# EasyEDA Pro project JumpingJack电路图工程文件.eprj

# Schematic Schematic1
Create Date: 2024-07-07; Page Name: JumpingJack; Project Name: JumpingJack; Schematic Name: Schematic1; Update Date: 2024-07-07; Company: 嘉立创EDA; Page Size: A2; Version: V1.0
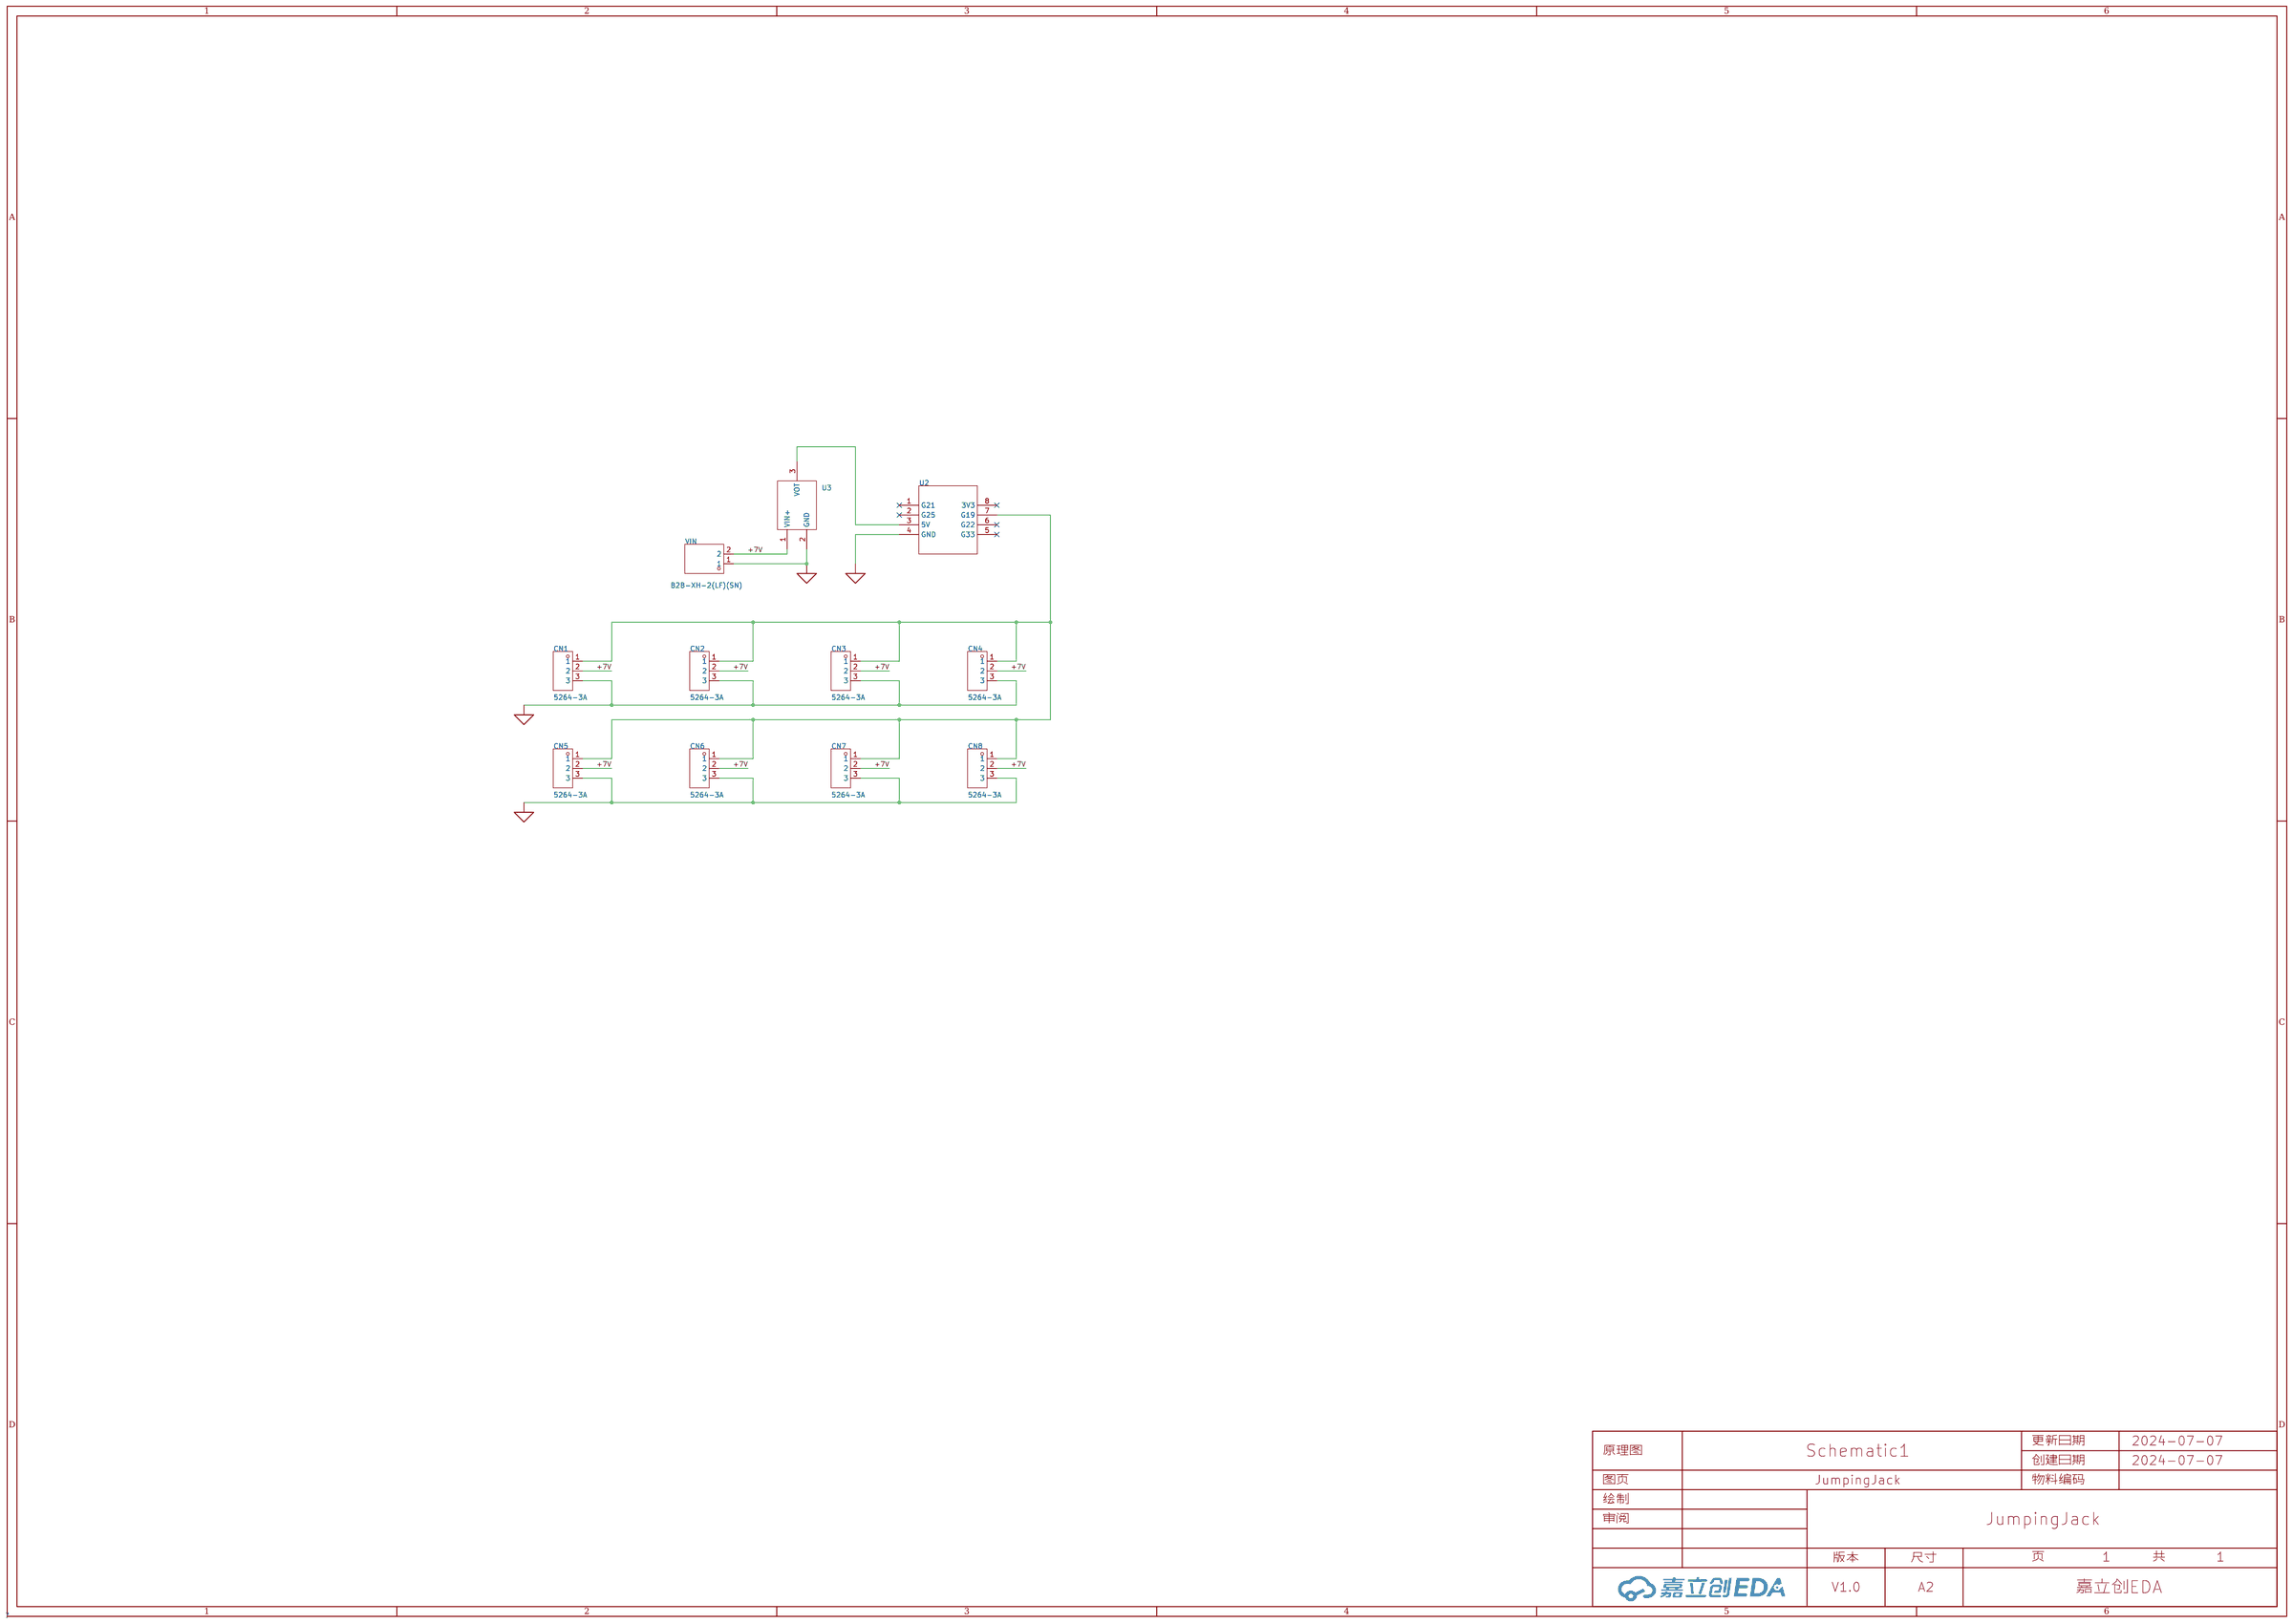
[diagram p0: schematic sheet]

## Parts
CN1  5264-3A  [CONN-TH_5264-3A]
CN2  5264-3A  [CONN-TH_5264-3A]
CN3  5264-3A  [CONN-TH_5264-3A]
CN4  5264-3A  [CONN-TH_5264-3A]
CN5  5264-3A  [CONN-TH_5264-3A]
CN6  5264-3A  [CONN-TH_5264-3A]
CN7  5264-3A  [CONN-TH_5264-3A]
CN8  5264-3A  [CONN-TH_5264-3A]
U2  -  [SOP-9]
U3  -  [SIP-3]
VIN  B2B-XH-2(LF)(SN)  [CONN-TH_B2B-XH-2-LF-SN]

## Library data of the parts
CN1-CN8 = 5264-3A: 插针结构:1x3P;间距:2.5mm;安装方式:-;参考系列:-;总PIN数:3P;排数:1;每排PIN数:3;行距:-;触头材质:-;; LCSC Part Name: 1x3P 间距:2.5mm; Supplier Part: C146133; Manufacturer: BOOMELE(博穆精密); Supplier Footprint: 插件,P=2.5mm; JLCPCB Part Class: 扩展库; Supplier: LCSC; Pins Structure: 1x3P; Pitch: 2.5mm; Number of Pins: 3P; Number of Rows: 1; Number of PINs Per Row: 3
U2 = ESP32
U3 = M78AR05
VIN = B2B-XH-2(LF)(SN): 插针结构:1x2P;间距:2.5mm;安装方式:直插;参考系列:XH;总PIN数:2P;排数:1;每排PIN数:2;行距:-;额定电流:3A;触头材质:黄铜;触头镀层:锡;工作温度范围:-25℃~+85℃;; LCSC Part Name: 1x2P 间距:2.5mm 直插 系列:XH; Supplier Part: C158014; Manufacturer: JST; Supplier Footprint: 插件,P=2.5mm; JLCPCB Part Class: 扩展库; Datasheet: https://atta.szlcsc.com/upload/public/pdf/source/20180928/C265283_F9DFEEBDB2CF642B6BDFAB4B77BD2680.pdf; Supplier: LCSC; Pins Structure: 1x2P; Pitch: 2.5mm; Mounting Style: 直插; Reference Series: XH; Number of Pins: 2P; Number of Rows: 1; Number of PINs Per Row: 2; Current Rating (Max): 3A; Contact Material: 黄铜; Contact Plating: 锡; Operating Temperature Range: -25℃~+85℃; Rated Voltage (Max): 250V; Plastic Material: 玻纤增强PA66; Flame Retardant Rating: UL94V-0; Colour: 白色; Z-Height of the Board: 7mm; X-Length of Bottom Edge on Board (Spacing Line): 7.4mm; Y-Width of Bottom Edge on Board: 6.75mm

## Nets
+7V: CN1.2 CN2.2 CN3.2 CN4.2 CN5.2 CN6.2 CN7.2 CN8.2 U3.1(VIN+) VIN.2
AGND: CN1.3 CN2.3 CN3.3 CN4.3 CN5.3 CN6.3 CN7.3 CN8.3 U2.4(GND) U3.2(GND) VIN.1
Net-(CN1-1): CN1.1 CN2.1 CN3.1 CN4.1 CN5.1 CN6.1 CN7.1 CN8.1 U2.7(G19)
Net-(U2-3): U2.3(5V) U3.3(VOT)

Not connected (* = marked no-connect by the designer): U2 1(G21)* 2(G25)* 5(G33)* 6(G22)* 8(3V3)*

# Board JumpingJack
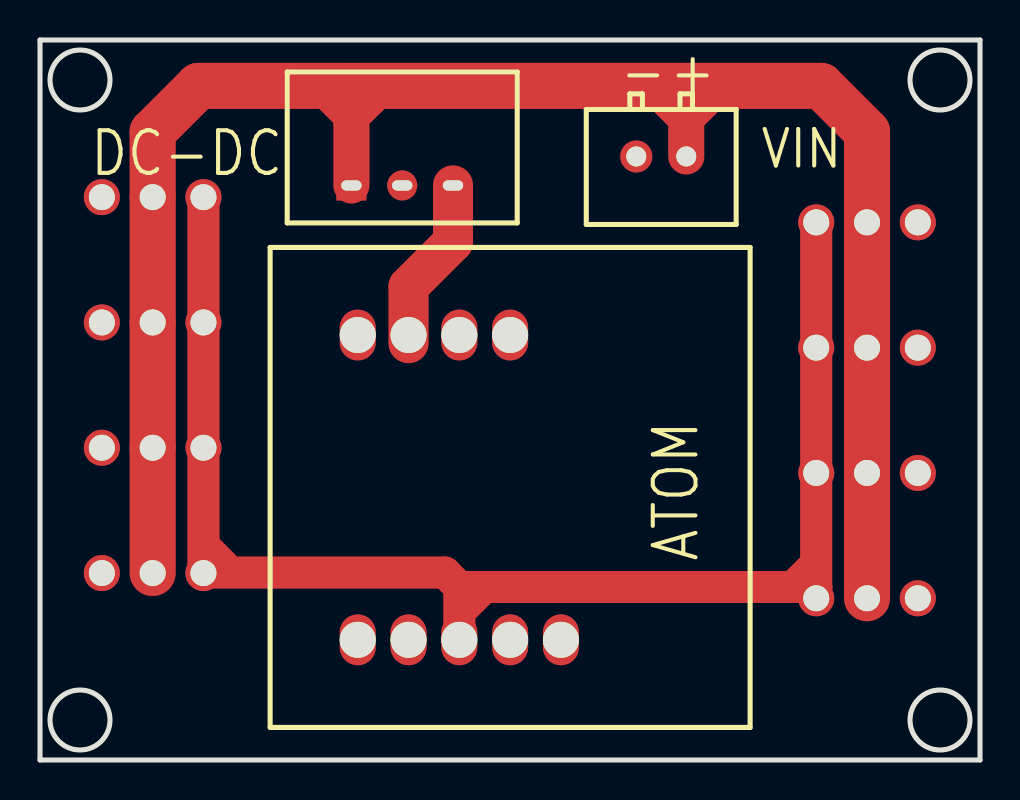
[diagram p1: board, top side]
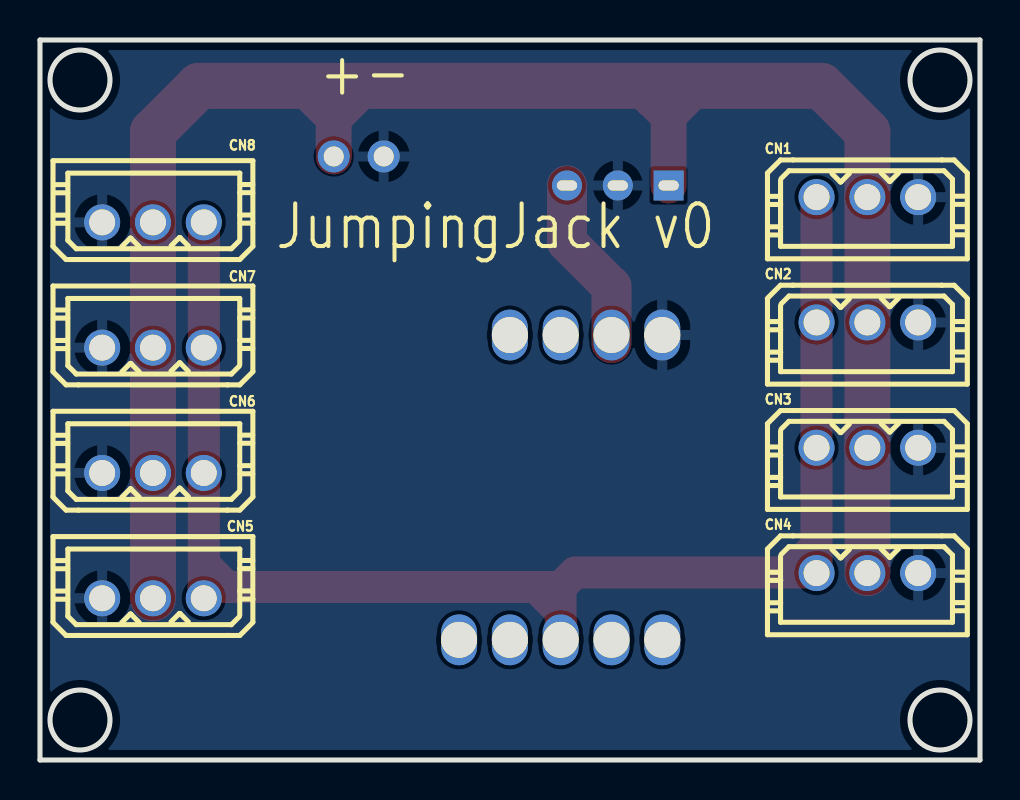
[diagram p2: board, bottom side, seen from below]

Outline 47 x 36 mm; copper layers: Top Layer, Bottom Layer. Coordinates in mm from the lower left corner of the outline.
Outline path: circle c2,34 r1.5 ; circle c2,2 r1.5 ; circle c45,34 r1.5 ; circle c45,2 r1.5 ; 0,36 47,36 47,0 0,0 0,36
Stack: Top Layer 0.035mm / Dielectric1 1.51mm FR4 er 4.5 / Bottom Layer 0.035mm

## Design rules (mm)
template: 自定义配置
spacing copperThickness1oz (default): track to track 0.102, other pairs 0.152 to 0.3
spacing copperThickness2oz: track to track 0.203, other pairs 0.152 to 0.3
track width copperThickness1oz (default): min 0.127, default 0.254, max 2.54
track width copperThickness2oz: min 0.203, default 0.254, max 2.54
differential pair differentialPair (default): width min 0.127, default 0.254, max 2.54; gap min 0.152, default 0.152
via viaSize (default): diameter min 0.5, default 0.61, max 10; hole min 0.3, default 0.305, max 6.3

## Placement (name value [footprint] x y rotation side)
CN1  5264-3A  [CONN-TH_5264-3A]  5.63 28.14 180 bottom
CN2  5264-3A  [CONN-TH_5264-3A]  5.63 21.88 180 bottom
CN3  5264-3A  [CONN-TH_5264-3A]  5.63 15.61 180 bottom
CN4  5264-3A  [CONN-TH_5264-3A]  5.63 9.35 180 bottom
CN5  5264-3A  [CONN-TH_5264-3A]  41.35 8.09 0 bottom
CN6  5264-3A  [CONN-TH_5264-3A]  41.35 14.35 0 bottom
CN7  5264-3A  [CONN-TH_5264-3A]  41.35 20.62 0 bottom
CN8  5264-3A  [CONN-TH_5264-3A]  41.35 26.88 0 bottom
NOREF  -  [SIP-3]  18.11 28.73 180 top
NOREF#2  -  [SOP-9]  11.51 25.63 0 top
VIN  B2B-XH-2(LF)(SN)  [CONN-TH_B2B-XH-2-LF-SN]  31.06 30.18 0 top

## Footprints (pads in the part's own frame, mm; a bottom-side part is the same pattern mirrored in y, then rotated)
CONN-TH_5264-3A
  round 1.8 hole 1.3: 1(-2.54,0) 2(0,0) 3(2.54,0)
CONN-TH_B2B-XH-2-LF-SN
  round 1.6 hole 1: 1(-1.25,0) 2(1.25,0)
SIP-3
  rect 1.5x1.5 hole 1.016x0.508: 1(2.54,0)
  round 1.5 hole 1.016x0.508: 2(0,0) 3(-2.54,0)
SOP-9
  oval 1.8x2.54 hole 1.8x1: 1(12,-4.38) 2(9.46,-4.38) 3(6.92,-4.38) 4(4.38,-4.38) 5(4.38,-19.62) 6(6.92,-19.62) 6(14.54,-19.62) 7(9.46,-19.62) 8(12,-19.62)

## Nets
+7V: CN1.2 CN2.2 CN3.2 CN4.2 CN5.2 CN6.2 CN7.2 CN8.2 NOREF.1 VIN.2
AGND: CN1.3 CN2.3 CN3.3 CN4.3 CN5.3 CN6.3 CN7.3 CN8.3 NOREF.2 NOREF#2.4 VIN.1
$1N480: NOREF.3 NOREF#2.3
$1N1002: CN1.1 CN2.1 CN3.1 CN4.1 CN5.1 CN6.1 CN7.1 CN8.1 NOREF#2.7

Pads without a net: NOREF#2 1 2 5 6 8

## Routing (per net, layer and track width the routed paths; a pad name or vN(x,y) marks a point on that pad's centre or on a via; arc(x,y) is an arc through that point)
+7V: length 95.6
  Top Layer w0.254: 32.31,33.69 32.33,33.71
  Top Layer w1.6: 33.46,33.1 32.73,32.38 ; 16.5,32.97 16.38,33.08 ; 16.5,32.97 16.02,32.49 ; 16.5,32.97 16.75,33.22 ; 31.93,32.32 31.2,33.04 ; 15.16,32.49 14.55,33.1
  Top Layer w1.8: 15.57,33.71 NOREF.1 ; VIN.2 32.31,33.69
  Top Layer w2.3: CN4.2 CN3.2 CN2.2 CN1.2 5.63,31.41 7.93,33.71 39.05,33.71 41.35,31.41 CN8.2 CN7.2 CN6.2 CN5.2
$1N480: length 8.8
  Top Layer w2: NOREF.3 20.65,25.9 18.43,23.67 18.43,20.84
$1N1002: length 74.6
  Top Layer w1.6: 38.59,9.58 37.87,8.86 ; 20.97,8.65 20.24,9.37 8.17,9.37 CN3.1 CN2.1 CN1.1 ; 20.97,8.65 20.97,5.6 ; 20.97,8.65 38.81,8.65 ; CN5.1 38.81,8.65 ; 38.81,8.65 CN6.1 CN7.1 CN8.1 ; 9.17,9.72 8.45,10.44 ; 22.03,8.46 21.3,7.74

## Copper pours and planes (outline as drawn; the poured copper is in the pictures)
AGND on Bottom Layer: 0,36.05 47,36.05 47,0.05 0,0.05

## Text on the board
Bottom Silkscreen Layer: - | + | JumpingJack v0
Top Silkscreen Layer: DC-DC | - | + | ATOM
